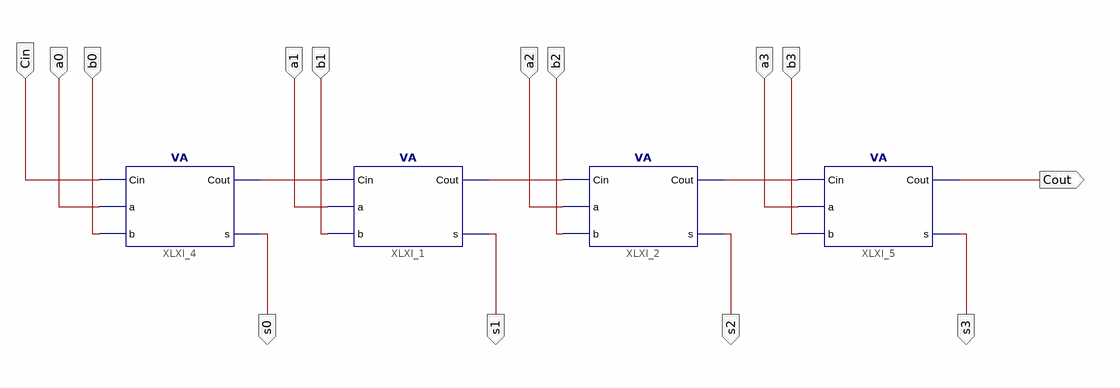
[diagram p0: schematic sheet 1]
// Xilinx ISE schematic RCA_4.sch (spartan3e) as structural Verilog: 4 symbols, 14 ports
module RCA_4 (
  input  Cin,
  input  a0,
  input  b0,
  input  a1,
  input  a2,
  input  b1,
  input  b2,
  input  b3,
  input  a3,
  output Cout,
  output s0,
  output s1,
  output s2,
  output s3
);

  wire XLXN_1, XLXN_2, XLXN_3;

  VA XLXI_1 (.Cin(XLXN_1), .a(a1), .b(b1), .Cout(XLXN_2), .s(s1));
  VA XLXI_2 (.Cin(XLXN_2), .a(a2), .b(b2), .Cout(XLXN_3), .s(s2));
  VA XLXI_5 (.Cin(XLXN_3), .a(a3), .b(b3), .Cout(Cout), .s(s3));
  VA XLXI_4 (.Cin(Cin), .a(a0), .b(b0), .Cout(XLXN_1), .s(s0));
endmodule
